# Altium schematic sheet llrf_afe_main.SchDoc: =GlobalProjectName
size 410 x 297 mm; SheetNumber: 1; SheetTotal: 20; PageSetup: Record=PageOptions|CenterHorizontal=True|CenterVertical=True|PrintScale=1.00|XCorrection=1.00|YCorrection=1.00|PrintKind=1|BorderSize=5000000|LeftOffset=0|BottomOffset=0|Orientation=2|PaperLength=1000|PaperWidth=1000|Scale=100|PaperSource=15|PrintQuality=1200|MediaType=1|DitherType=10|PaperKind=A3|PrintScaleMode=1; Weight: -; ScaleFactor: -
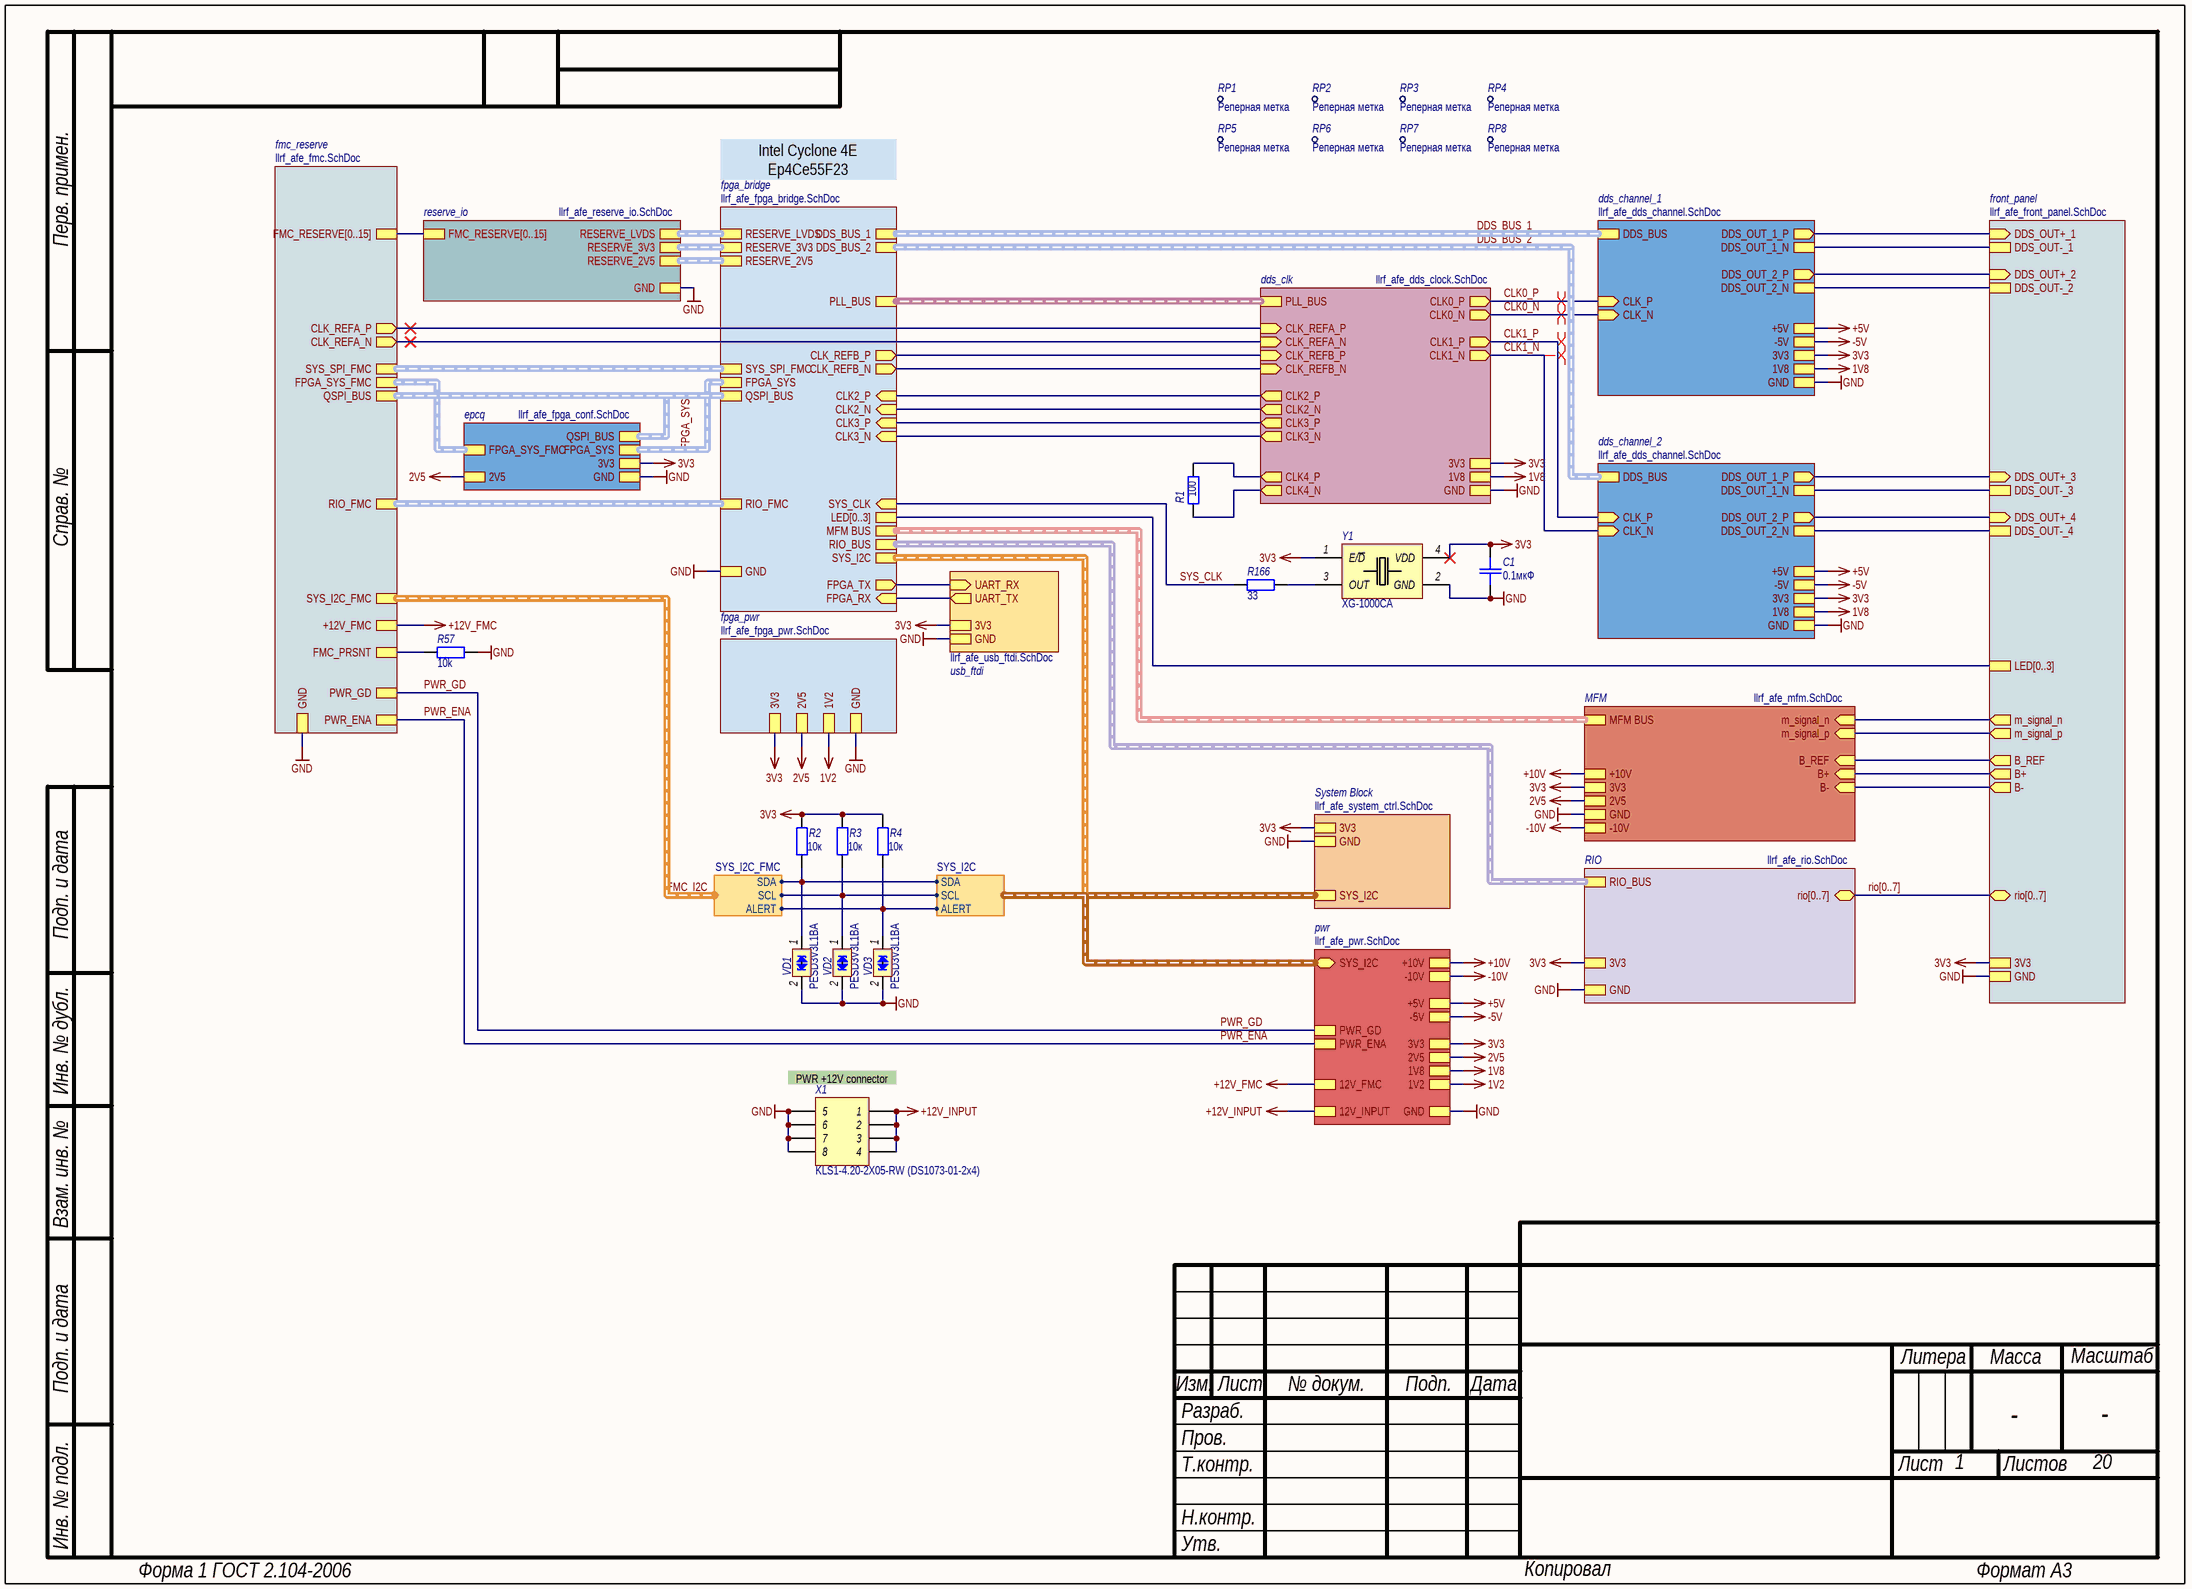
[diagram p0: llrf_afe_main.SchDoc]

## Parts
C1  0.1мкФ  [SMD_C0402]
R1  100  [SMD_0603]
R2  10к  [SMD_0603]
R3  10к  [SMD_0603]
R4  10к  [SMD_0603]
R57  10k  [SMD_0603]
R166  33  [SMD_0603]
RP1  Наименование: Реперная метка  [ReperPoint]  (hidden comment: RP)
RP2  Наименование: Реперная метка  [ReperPoint]  (hidden comment: RP)
RP3  Наименование: Реперная метка  [ReperPoint]  (hidden comment: RP)
RP4  Наименование: Реперная метка  [ReperPoint]  (hidden comment: RP)
RP5  Наименование: Реперная метка  [ReperPoint]  (hidden comment: RP)
RP6  Наименование: Реперная метка  [ReperPoint]  (hidden comment: RP)
RP7  Наименование: Реперная метка  [ReperPoint]  (hidden comment: RP)
RP8  Наименование: Реперная метка  [ReperPoint]  (hidden comment: RP)
VD1  Наименование: PESD3V3L1BA  [SOD-323]  (hidden comment: PESD3V3)
VD2  Наименование: PESD3V3L1BA  [SOD-323]  (hidden comment: PESD3V3)
VD3  Наименование: PESD3V3L1BA  [SOD-323]  (hidden comment: PESD3V3)
X1  Наименование: KLS1-4.20-2X05-RW (DS1073-01-2x4)  [KLS1-4.20-2X04]  (hidden comment: KLS1-4.20-2X05-R (DS1073-01-2x4))
Y1  XG-1000CA  [SMD_7050_Crystal_Oscillator]

## Sub-sheets
dds_channel_1 = llrf_afe_dds_channel.SchDoc: DDS_OUT_1_N, DDS_BUS (harness DDS_BUS), 3V3, +5V, GND, DDS_OUT_2_P (out), -5V, 1V8, CLK_P (in), DDS_OUT_1_P (out), CLK_N (in), DDS_OUT_2_N
dds_channel_2 = llrf_afe_dds_channel.SchDoc: DDS_OUT_1_N, DDS_BUS (harness SYS_I2C), 3V3, +5V, DDS_OUT_2_P (out), -5V, 1V8, CLK_P (in), CLK_N (in), DDS_OUT_2_N, GND, DDS_OUT_1_P (out)
dds_clk = llrf_afe_dds_clock.SchDoc: CLK1_P (out), CLK1_N (out), CLK3_P (out), CLK3_N (out), CLK0_N (out), CLK0_P (out), PLL_BUS (harness SYS_I2C), 3V3, GND, 1V8, CLK4_P (out), CLK4_N (out), CLK_REFA_N (in), CLK_REFA_P (in), CLK_REFB_P (in), CLK_REFB_N (in), CLK2_P (out), CLK2_N (out)
epcq = llrf_afe_fpga_conf.SchDoc: QSPI_BUS (harness QSPI_BUS), 3V3, GND, FPGA_SYS (harness FPGA_SYS_FMC), FPGA_SYS_FMC (harness FPGA_SYS_FMC), 2V5
fmc_reserve = llrf_afe_fmc.SchDoc: CLK_REFA_N (out), CLK_REFA_P (out), SYS_I2C_FMC (harness SYS_I2C_FMC), +12V_FMC, PWR_GD, PWR_ENA, QSPI_BUS (harness QSPI_BUS), RIO_FMC (harness RIO_FMC), FMC_RESERVE[0..15], SYS_SPI_FMC (harness SYS_SPI_FMC), FPGA_SYS_FMC (harness FPGA_SYS_FMC), GND, FMC_PRSNT
fpga_bridge = llrf_afe_fpga_bridge.SchDoc: MFM BUS (harness SYS_I2C), PLL_BUS (harness SYS_I2C), RIO_BUS (harness SYS_I2C), SYS_I2C (harness SYS_I2C), SYS_SPI_FMC (harness SYS_SPI_FMC), RESERVE_LVDS (harness RESERVE_LVDS), RESERVE_3V3 (harness RESERVE_3V3), RESERVE_2V5 (harness RESERVE_2V5), QSPI_BUS (harness QSPI_BUS), FPGA_SYS (harness FPGA_SYS), RIO_FMC (harness RIO_FMC), DDS_BUS_2 (harness SYS_I2C), DDS_BUS_1, CLK_REFB_N (out), CLK_REFB_P (out), CLK2_P (in), CLK2_N (in), CLK3_N (in), CLK3_P (in), SYS_CLK (in), FPGA_TX (out), FPGA_RX (in), GND, LED[0..3]
fpga_pwr = llrf_afe_fpga_pwr.SchDoc: GND, 2V5, 1V2, 3V3
front_panel = llrf_afe_front_panel.SchDoc: DDS_OUT+_1 (in), DDS_OUT-_1, DDS_OUT+_2 (in), DDS_OUT-_2, m_signal_n (out), m_signal_p (out), B_REF (out), B+ (out), B- (out), rio[0..7] (bidir), DDS_OUT+_3 (in), DDS_OUT-_3, DDS_OUT+_4 (in), DDS_OUT-_4, GND, 3V3, LED[0..3]
MFM = llrf_afe_mfm.SchDoc: m_signal_n (in), MFM BUS (harness SYS_I2C), m_signal_p (in), 2V5, +10V, GND, 3V3, -10V, B+ (in), B- (in), B_REF (in)
pwr = llrf_afe_pwr.SchDoc: 1V8, 2V5, 3V3, +5V, -5V, GND, 1V2, -10V, +10V, 12V_INPUT, SYS_I2C (bidir, harness SYS_I2C), 12V_FMC, PWR_ENA, PWR_GD
reserve_io = llrf_afe_reserve_io.SchDoc: FMC_RESERVE[0..15], RESERVE_LVDS, RESERVE_3V3, RESERVE_2V5, GND
RIO = llrf_afe_rio.SchDoc: RIO_BUS (harness SYS_I2C), 3V3, GND, rio[0..7] (bidir)
System Block = llrf_afe_system_ctrl.SchDoc: SYS_I2C (harness SYS_I2C), 3V3, GND
usb_ftdi = llrf_afe_usb_ftdi.SchDoc: UART_TX (out), UART_RX (in), GND, 3V3

## Harnesses
SYS_I2C_FMC: SDA, SCL, ALERT
SYS_I2C: SDA, SCL, ALERT

## Nets
1V2: sheet pwr/1V2, sheet fpga_pwr/1V2
1V8: sheet dds_clk/1V8, sheet pwr/1V8, sheet dds_channel_1/1V8, sheet dds_channel_2/1V8
2V5: sheet MFM/2V5, sheet pwr/2V5, sheet fpga_pwr/2V5, sheet epcq/2V5
3V3: C1.2 R2.2 R3.2 R4.2 Y1.1(E/~{D}) Y1.4(VDD) ; sheet MFM/3V3, sheet RIO/3V3, sheet System Block/3V3, sheet front_panel/3V3, sheet dds_clk/3V3, sheet pwr/3V3, sheet fpga_pwr/3V3, sheet usb_ftdi/3V3, sheet epcq/3V3, sheet dds_channel_1/3V3, sheet dds_channel_2/3V3
+5V: sheet pwr/+5V, sheet dds_channel_1/+5V, sheet dds_channel_2/+5V
+10V: sheet MFM/+10V, sheet pwr/+10V
+12V_FMC: sheet pwr/12V_FMC, sheet fmc_reserve/+12V_FMC
+12V_INPUT: X1.1 X1.2 X1.3 X1.4 ; sheet pwr/12V_INPUT
-5V: sheet pwr/-5V, sheet dds_channel_1/-5V, sheet dds_channel_2/-5V
-10V: sheet MFM/-10V, sheet pwr/-10V
GND: C1.1 R57.1 VD1.2(cathode_2) VD2.2(cathode_2) VD3.2(cathode_2) X1.5 X1.6 X1.7 X1.8 Y1.2(GND) ; sheet MFM/GND, sheet RIO/GND, sheet System Block/GND, sheet fpga_bridge/GND, sheet front_panel/GND, sheet dds_clk/GND, sheet pwr/GND, sheet fpga_pwr/GND, sheet usb_ftdi/GND, sheet epcq/GND, sheet reserve_io/GND, sheet dds_channel_1/GND, sheet dds_channel_2/GND, sheet fmc_reserve/GND
CLK0_N: sheet dds_clk/CLK0_N, sheet dds_channel_1/CLK_N
CLK0_P: sheet dds_clk/CLK0_P, sheet dds_channel_1/CLK_P
CLK1_N: sheet dds_clk/CLK1_N, sheet dds_channel_2/CLK_N
CLK1_P: sheet dds_clk/CLK1_P, sheet dds_channel_2/CLK_P
FMC_I2C.ALERT: R4.1 VD3.1(cathode_1) ; sheet fmc_reserve/SYS_I2C_FMC.ALERT, sheet System Block/SYS_I2C.ALERT
FMC_I2C.SCL: R3.1 VD2.1(cathode_1) ; sheet fmc_reserve/SYS_I2C_FMC.SCL, sheet System Block/SYS_I2C.SCL
FMC_I2C.SDA: R2.1 VD1.1(cathode_1) ; sheet fmc_reserve/SYS_I2C_FMC.SDA, sheet System Block/SYS_I2C.SDA
PWR_ENA: sheet pwr/PWR_ENA, sheet fmc_reserve/PWR_ENA
PWR_GD: sheet pwr/PWR_GD, sheet fmc_reserve/PWR_GD
SYS_CLK: R166.2 ; sheet fpga_bridge/SYS_CLK
NetR1_1: R1.1 ; sheet dds_clk/CLK4_N
NetR1_2: R1.2 ; sheet dds_clk/CLK4_P
NetR57_2: R57.2 ; sheet fmc_reserve/FMC_PRSNT
NetR166_1: R166.1 Y1.3(OUT)
(unnamed): sheet MFM/m_signal_n, sheet front_panel/m_signal_n
(unnamed): sheet MFM/m_signal_p, sheet front_panel/m_signal_p
(unnamed): sheet MFM/B+, sheet front_panel/B+
(unnamed): sheet MFM/B-, sheet front_panel/B-
(unnamed): sheet MFM/B_REF, sheet front_panel/B_REF
(unnamed): sheet fpga_bridge/CLK_REFB_N, sheet dds_clk/CLK_REFB_N
(unnamed): sheet fpga_bridge/CLK_REFB_P, sheet dds_clk/CLK_REFB_P
(unnamed): sheet fpga_bridge/CLK2_P, sheet dds_clk/CLK2_P
(unnamed): sheet fpga_bridge/CLK2_N, sheet dds_clk/CLK2_N
(unnamed): sheet fpga_bridge/CLK3_N, sheet dds_clk/CLK3_N
(unnamed): sheet fpga_bridge/CLK3_P, sheet dds_clk/CLK3_P
(unnamed): sheet fpga_bridge/FPGA_TX, sheet usb_ftdi/UART_RX
(unnamed): sheet fpga_bridge/FPGA_RX, sheet usb_ftdi/UART_TX
(unnamed): sheet front_panel/DDS_OUT+_1, sheet dds_channel_1/DDS_OUT_1_P
(unnamed): sheet front_panel/DDS_OUT-_1, sheet dds_channel_1/DDS_OUT_1_N
(unnamed): sheet front_panel/DDS_OUT+_2, sheet dds_channel_1/DDS_OUT_2_P
(unnamed): sheet front_panel/DDS_OUT-_2, sheet dds_channel_1/DDS_OUT_2_N
(unnamed): sheet front_panel/DDS_OUT+_3, sheet dds_channel_2/DDS_OUT_1_P
(unnamed): sheet front_panel/DDS_OUT-_3, sheet dds_channel_2/DDS_OUT_1_N
(unnamed): sheet front_panel/DDS_OUT+_4, sheet dds_channel_2/DDS_OUT_2_P
(unnamed): sheet front_panel/DDS_OUT-_4, sheet dds_channel_2/DDS_OUT_2_N
(unnamed): sheet dds_clk/CLK_REFA_N, sheet fmc_reserve/CLK_REFA_N
(unnamed): sheet dds_clk/CLK_REFA_P, sheet fmc_reserve/CLK_REFA_P

## Buses and harness runs
bus rio[0..7] = sheet front_panel/rio[0..7] = sheet RIO/rio[0..7]
bus sheet fmc_reserve/FMC_RESERVE[0..15] = sheet reserve_io/FMC_RESERVE[0..15]
bus sheet fpga_bridge/LED[0..3] = sheet front_panel/LED[0..3]
harness DDS_BUS_1 = sheet dds_channel_1/DDS_BUS = sheet fpga_bridge/DDS_BUS_1
harness DDS_BUS_2 = sheet dds_channel_2/DDS_BUS = sheet fpga_bridge/DDS_BUS_2
harness FMC_I2C = sheet fmc_reserve/SYS_I2C_FMC
harness FPGA_SYS = sheet epcq/FPGA_SYS = sheet fpga_bridge/FPGA_SYS
harness sheet dds_clk/PLL_BUS = sheet fpga_bridge/PLL_BUS
harness sheet epcq/FPGA_SYS_FMC = sheet fmc_reserve/FPGA_SYS_FMC
harness sheet epcq/QSPI_BUS = sheet fmc_reserve/QSPI_BUS = sheet fpga_bridge/QSPI_BUS
harness sheet fmc_reserve/RIO_FMC = sheet fpga_bridge/RIO_FMC
harness sheet fmc_reserve/SYS_SPI_FMC = sheet fpga_bridge/SYS_SPI_FMC
harness sheet fpga_bridge/MFM BUS = sheet MFM/MFM BUS
harness sheet fpga_bridge/RESERVE_2V5 = sheet reserve_io/RESERVE_2V5
harness sheet fpga_bridge/RESERVE_3V3 = sheet reserve_io/RESERVE_3V3
harness sheet fpga_bridge/RESERVE_LVDS = sheet reserve_io/RESERVE_LVDS
harness sheet fpga_bridge/RIO_BUS = sheet RIO/RIO_BUS
harness sheet fpga_bridge/SYS_I2C = sheet pwr/SYS_I2C = sheet System Block/SYS_I2C

## Layout directives
differential pair: CLK0_N, CLK0_P, CLK1_N, CLK1_P

## Notes on the sheet
- Intel Cyclone 4E
  Ep4Ce55F23
- (near X1) PWR +12V connector
- Перв. примен.
- Справ. №
- Подп. и дата
- Инв. № дубл.
- Взам. инв. №
- Изм.
- Разраб.
- Лист
- № докум.
- Подп.
- Дата
- Литера
- Масса
- Масштаб
- Пров.
- Т.контр.
- Листов
- Н.контр.
- Утв.
- Инв. № подл.
- Форма 1 ГОСТ 2.104-2006
- Копировал
- Формат А3

## Library data of the parts
C1 = Capacitor: Назначение: SMD-конденсатор; Наименование: Конденсатор; Потребление, Вт: 0; Точность: %; Напряжение: В; Value: 0.1мкФ; Диэлектрик: *
R1-R4 R57 R166 = Resistor: Наименование: Резистор; Назначение: SMD-резистор; Потребление, Вт: 0,001
  R1: Value: 100
  R2-R4: Value: 10к
  R57: Value: 10k
  R166: Value: 33
RP1-RP8 = RP: Назначение: реперная метка для автоматического монтажа
VD1-VD3 = PESDxL1BA: Low capacitance bidirectional ESD protection diodes; Назначение: ESD защитные диоды; Потребление, Вт: 0.0; ComponentLink1Description: DataSheet; ComponentLink1URL: https://static.chipdip.ru/lib/635/DOC005635911.pdf
X1 = KLS1-4.20-2X05-R: Вилка на плату угловая 4.2мм 8pin со втулками (дополнительное питание PCIe); Потребление, Вт: 0,000; Назначение: Вилка на плату угловая 4.2мм 8pin со втулками; ComponentLink1Description: DataSheet; ComponentLink1URL: https://img80002547.weyesimg.com/uploads/www.klselectronic.com/addon/15632682388191.pdf
Y1 = Crystal_Oscillator: Crystall oscillator, CMOS, 3.3V, SMD7050; Назначение: Crystall oscillator, CMOS, 3.3V, SMD7050, 100 МГц; Потребление, Вт: 0.12; ComponentLink1Description: DataSheet; ComponentLink1URL: https://ru.mouser.com/datasheet/2/137/G_1000CA_en-1003255.pdf; Наименование: XG-1000CA